# Altium schematic sheet SENSOR.SchDoc
size A; SheetNumber: 2; SheetTotal: 4
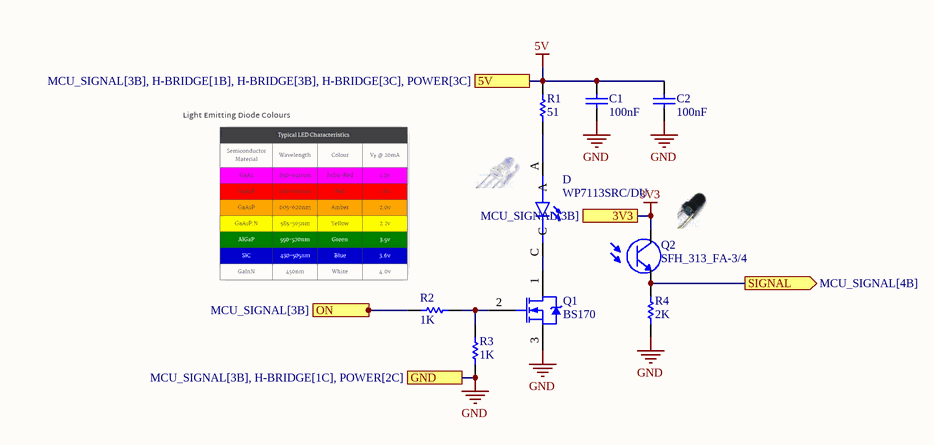
[diagram p0: SENSOR.SchDoc]

## Parts
C1  100nF  [CAPC2013X135X45LL10T25]
C2  100nF  [CAPC2013X135X45LL10T25]
D  WP7113SRC/DU  [LED_WP7113SRC/DU]
Q1  BS170  [ONSC-TO-92-3-29-11]
Q2  SFH_313_FA-3/4  [XDCR_SFH_313_FA-3/4]
R1  51  [RESC2013X60X35ML10T20]
R2  1K  [RESC2013X60X35ML10T20]
R3  1K  [RESC2013X60X35ML10T20]
R4  2K  [RESC2013X60X35ML10T20]

## Ports
3V3 (see MCU_SIGNAL[3B]), 5V (see MCU_SIGNAL[3B], H-BRIDGE[1B], H-BRIDGE[3B], H-BRIDGE[3C], POWER[3C]), GND (see MCU_SIGNAL[3B], H-BRIDGE[1C], POWER[2C]), ON (in, see MCU_SIGNAL[3B]), SIGNAL (out, see MCU_SIGNAL[4B])

## Nets
3V3: Q2.2(C) ; port 3V3
5V: C1.2 C2.2 R1.2 ; port 5V
GND: C1.1 C2.1 Q1.3(S) R3.1 R4.1 ; port GND
ON: R2.2 ; port ON
SIGNAL: Q2.1(E) R4.2 ; port SIGNAL
NetD_A: D.A R1.1
NetD_C: D.C Q1.1(D)
NetQ1_2: Q1.2(G) R2.1 R3.2

## Library data of the parts
C1 C2 = CMP-1662-00015-2: Chip Capacitor, 4.7 uF, +/- 10%, 16 V, -55 to 85 degC, 0805 (2012 Metric), RoHS, Tape and Reel; PartNumber: GRM21BR61C475KA88L; Voltage Rating (DC): 16 V; Capacitance: 4.7 uF; Type (Capacitors): X5R; Case\/Package: 0805; Pins: 2; DatasheetVersion: 03/2016; REACH SVHC: No SVHC; Tolerance: 10%; Width: 1.25 mm; Mount: Surface Mount; ComponentLink1Description: Manufacturer URL; Case Code (Metric): 2012; PackageDescription: 2-Pin Surface Mount Device, Body 2 x 1.25 mm; Height: 1.25 mm; Voltage Rating: 16 V; Max Operating Temperature: 85 degC; RoHSCompliant: true; Length: 2 mm; ComponentLink1URL: http://www.murata.com/; Mounting Technology: Surface Mount; Packaging: Tape and Reel; Min Operating Temperature: -55 degC; ComponentLink2Description: Datasheet; Case Code (Imperial): 0805; Radiation Hardening: No; Package Quantity: 3000; PackageReference: 0805; ComponentLink2URL: http://search.murata.co.jp/Ceramy/image/img/A01X/G101/ENG/GRM21BR61C475KA88-01.pdf
D = WP7113SRC/DU: Red 640nm LED Indication - Discrete 1.85V Radial; MF: Kingbright; MP: WP7113SRC/DU; Value: *; SnapEDA_Link: https://www.snapeda.com/parts/WP7113SRC/DU/Kingbright/view-part/826988/?ref=snap; Price: None; Package: Radial Kingbright; Availability: Unavailable
Q1 = CMP-1058-00929-1: Small Signal MOSFET, 500 mA, 60 V, N-Channel, 3-Pin TO-92, Bulk Box; Manufacturer: On Semiconductor; VGS Max (V): 20; Configuration: Single; PD Max (W): 0.35; VGS(th) Max (V): 3; ID Max (A): 0.5; V(BR)DSS Min (V): 60; Channel Polarity: N Channel; PackageDescription: 3-Pin Transistor Outline, Body 4.825 x 3.685 mm, Pitch 1.27 mm; Package Type: TO-92; ComponentLink1Description: Manufacturer URL; ComponentLink1URL: http://www.onsemi.com/; DatasheetVersion: Rev. 6; ComponentLink3Description: Package Specification; PartNumber: BS170; ComponentLink2URL: http://www.onsemi.com/pub_link/Collateral/BS170-D.PDF; PackageVersion: Rev. AM; Mounting Technology: Through Hole; PackageReference: TO-92-3-29-11_AM_SL; ComponentLink2Description: Datasheet; ComponentLink3URL: http://www.onsemi.cn/pub_link/Collateral/2N6426-D.PDF; Packing: Bulk Box
Q2 = SFH_313_FA-3/4: Phototransistors 870nm Top View Radial - 2 Leads; MF: OSRAM Opto; MP: SFH 313 FA-3/4; Package: Radial-2 Osram Opto; Value: *; Check_prices: https://www.snapeda.com/parts/SFH%20313%20FA-3/4/OSRAM%20Opto%20Semiconductors%20Inc./view-part/240737/?ref=eda; Digi-Key_Part_Number: 475-3328-ND; SnapEDA_Link: https://www.snapeda.com/parts/SFH%20313%20FA-3/4/OSRAM%20Opto%20Semiconductors%20Inc./view-part/240737/?ref=snap
R1-R4 = CMP-2100-03671-1: Chip Resistor, 1 KOhm, +/- 1%, 125 mW, -55 to 155 degC, 0805 (2012 Metric), RoHS, Tape and Reel; Manufacturer: Yageo; Temperature Coefficient: 100ppm/degreesC; Voltage Rating (DC): 150V; Max Power Dissipation: 125mW; Resistance: 1KOhm; Number of Pins: 2; Number of Terminations: 2; Datasheet URL: http://www.yageo.com/NewPortal/yageodocoutput?fileName=/pdf/R-Chip/PYu-RC_Group_51_RoHS_L_5.pdf; Length: 0.079inch; Package Description: 2-Pin Surface Mounted Device, Body 2 x 1.25 mm; Depth: 1.25mm; Height: 0.024inch; Military Standard: Not; Case/Package: 0805; Package Reference: 0805; RoHSCompliant: true; Lead Free: LeadFree; Packaging: TapeandReel; Package Quantity: 1; Datasheet Version: Rev. 5, 10/2016; Tolerance: 1%; Min Operating Temperature: -55degC; Voltage Rating: 150V; Composition: ThickFilm; Case Code (Imperial): 0805; Power Rating: 125mW; Width: 0.049inch; Case Code (Metric): 2012; Manufacturer URL: http://www.yageo.com/; Max Operating Temperature: 155degC; REACH SVHC: Unknown; Termination: SMD/SMT